# Altium schematic sheet Sheet1.SchDoc
size A4; SheetNumber: 1; SheetTotal: 1
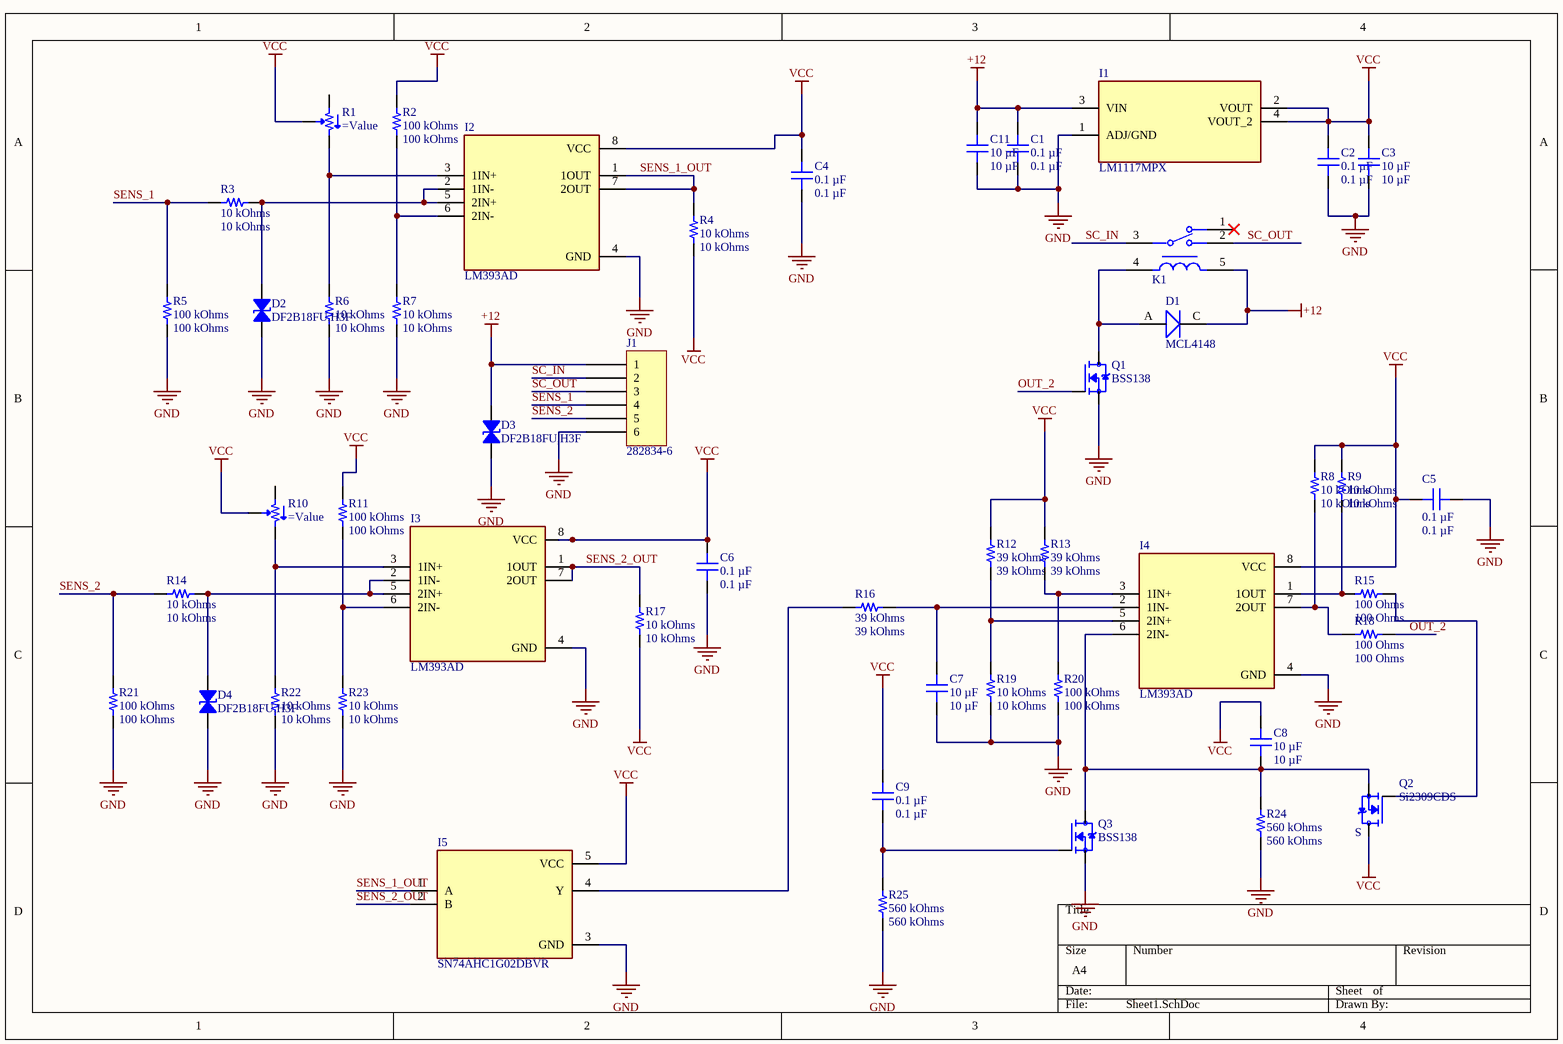
[diagram p0: Sheet1.SchDoc]

## Parts
C1  0.1 µF  [CAP 0603_1608]
C2  0.1 µF  [CAP 0603_1608]
C3  10 µF  [CAP 1206_3216 - 0.8MM]
C4  0.1 µF  [CAP 0603_1608]
C5  0.1 µF  [CAP 0603_1608]
C6  0.1 µF  [CAP 0603_1608]
C7  10 µF  [CAP 1206_3216 - 0.8MM]
C8  10 µF  [CAP 1206_3216 - 0.8MM]
C9  0.1 µF  [CAP 0603_1608]
C11  10 µF  [CAP 1206_3216 - 0.8MM]
D1  MCL4148  [MC4148]
D2  DF2B18FU,H3F  [SOD323]
D3  DF2B18FU,H3F  [SOD323]
D4  DF2B18FU,H3F  [SOD323]
I1  LM1117MPX  [LM1117]
I2  LM393AD  [PCBComponent_1]
I3  LM393AD  [PCBComponent_1]
I4  LM393AD  [PCBComponent_1]
I5  SN74AHC1G02DBVR  [PCBComponent_1 - duplicate]
J1  282834-6  [TE 282834-6]
K1  CP1-12V  [Panasonic_0_MFG]  (value not drawn)
Q1  BSS138  [BSS138]
Q2  Si2309CDS  [BSS138]
Q3  BSS138  [BSS138]
R1  (no value)  [BOURNS TRIMPOT 3296W]
R2  100 kOhms  [RES 0603_1608]
R3  10 kOhms  [RES 0603_1608]
R4  10 kOhms  [RES 0603_1608]
R5  100 kOhms  [RES 0603_1608]
R6  10 kOhms  [RES 0603_1608]
R7  10 kOhms  [RES 0603_1608]
R8  10 kOhms  [RES 0603_1608]
R9  10 kOhms  [RES 0603_1608]
R10  (no value)  [BOURNS TRIMPOT 3296W]
R11  100 kOhms  [RES 0603_1608]
R12  39 kOhms  [RES 0603_1608]
R13  39 kOhms  [RES 0603_1608]
R14  10 kOhms  [RES 0603_1608]
R15  100 Ohms  [RES 0603_1608]
R16  39 kOhms  [RES 0603_1608]
R17  10 kOhms  [RES 0603_1608]
R18  100 Ohms  [RES 0603_1608]
R19  10 kOhms  [RES 0603_1608]
R20  100 kOhms  [RES 0603_1608]
R21  100 kOhms  [RES 0603_1608]
R22  10 kOhms  [RES 0603_1608]
R23  10 kOhms  [RES 0603_1608]
R24  560 kOhms  [RES 0603_1608]
R25  560 kOhms  [RES 0603_1608]

## Nets
+12: C1.2 C11.2 D1.C(K) D3.2 I1.3(VIN) J1.1 K1.5(COIL)
GND: C1.1 C2.1 C3.1 C4.2 C5.2 C6.2 C7.1 C11.1 D2.1 D3.1 D4.1 I1.1(ADJ/GND) I2.4(GND) I3.4(GND) I4.4(GND) I5.3(GND) J1.6 Q1.2(S) Q3.2(S) R5.1 R6.2 R7.2 R19.1 R20.1 R21.1 R22.1 R23.1 R24.1 R25.1
VCC: C2.2 C3.2 C4.1 C5.1 C6.1 C8.2 C9.1 I1.2(VOUT) I1.4(VOUT_2) I2.8(VCC) I3.8(VCC) I4.8(VCC) I5.5(VCC) Q2.3(D) R1.2 R2.2 R4.2 R8.2 R9.2 R10.2 R11.2 R12.2 R13.2 R17.1
OUT_2: Q1.1(G) R18.2
SC_IN: J1.2 K1.3(COM)
SC_OUT: J1.3 K1.2(NO)
SENS_1: J1.4 R3.1 R5.2
SENS_1_OUT: I2.1(1OUT) I2.7(2OUT) I5.1(A) R4.1
SENS_2: J1.5 R14.2 R21.2
SENS_2_OUT: I3.1(1OUT) I3.7(2OUT) I5.2(B) R17.2
NetC7_2: C7.2 I4.2(1IN-) R16.2
NetC8_1: C8.1 I4.6(2IN-) Q2.2(S) Q3.3(D) R24.2
NetC9_2: C9.2 Q3.1(G) R25.2
NetD1_A: D1.A K1.4(COIL) Q1.3(D)
NetD2_2: D2.2 I2.2(1IN-) I2.5(2IN+) R3.2
NetD4_2: D4.2 I3.2(1IN-) I3.5(2IN+) R14.1
NetI2_3: I2.3(1IN+) R1.3 R6.1
NetI2_6: I2.6(2IN-) R2.1 R7.1
NetI3_3: I3.3(1IN+) R10.3 R22.2
NetI3_6: I3.6(2IN-) R11.1 R23.2
NetI4_1: I4.1(1OUT) R9.1 R15.1
NetI4_3: I4.3(1IN+) R13.1 R20.2
NetI4_5: I4.5(2IN+) R12.1 R19.2
NetI4_7: I4.7(2OUT) R8.1 R18.1
NetI5_4: I5.4(Y) R16.1
NetQ2_1: Q2.1(G) R15.2

Not connected (* = marked no-connect by the designer): K1 1(NC)*; R1 1; R10 1

## Library data of the parts
C1 C2 C4-C6 C9 = 0603B104M160CT: CAP CER 0.1UF 16V X7R 0603; Part Number: 0603B104M160CT; Value: 0.1 µF
C3 C7 C8 C11 = C1206C106M4RAC7800: CAP CER 10UF 16V X7R 1206; Part Number: C1206C106M4RAC7800; Value: 10 µF
D2-D4 = DF2B18FU,H3F: TVS DIODE 12VWM 33VC USC; Part Number: DF2B18FU,H3F
J1 = 282834-6: TERM BLK 6P SIDE ENT 2.54MM PCB; Part Number: 282834-6
K1 = CP1-12V: Relays 12VDC 225Ohm 20(NO)/10(NC)A SPDT(14mm 13mm 9.5mm) THT Automotive Relay Automotive; Manufacturer: Panasonic; Coil Current: 53.3mA; Coil Power: 640mW; Coil Resistance: 225Ω; Coil Type: Non-Latching; Coil Voltage: 12V; Number Of Contacts: 1; Standoff Height: 0.3mm; Symbol Hash: fe78fdfa570af3e722bc44d6543b65f3de2fc8a39f1146d236955811f6049f9c; Datasheet Path: datasheets/Relay_Panasonic_CP1-12V_eec.pdf; Ambient Temperature Range High: +85°C; Ambient Temperature Range Low: -40°C; Automotive: No; Category: Relay; ComponentLink1Description: Upverter; ComponentLink1URL: https://upverter.com/part/id/f0cb69e971a210b5/; ComponentLink2Description: Datasheet; ComponentLink2URL: http://datasheet.octopart.com/CP1-12V-Panasonic-datasheet-10206954.pdf; Device Class L1: Electromechanical; Device Class L2: Relays; Device Class L3: Power Relays; Digikey Description: RELAY AUTOMOTIVE SPDT 20A 12V; Digikey Part Number: 255-1939-ND; Height: 9.8mm; Lead Free: Yes; Mouser Description: Relays 12VDC 225Ohm 20(NO)/10(NC)A SPDT(14mm 13mm 9.5mm) THT Automotive Relay Automotive; Mouser Part Number: 769-CP1-12V; Package: 0; Part Number: CP1-12V; RoHS: TRUE; Supplier 1: Digi-Key; Supplier 2: Mouser; Supplier Part Number 1: 255-1939-ND; Supplier Part Number 2: 769-CP1-12V; Temperature: to; Throw Configuration: SPDT; helpURL: https://upverter.com/part/id/f0cb69e971a210b5/
R1 R10 = 3296W-1-203A: TRIMMER 20K OHM 0.5W PC PIN TOP; Part Number: 3296W-1-203A
R2 R5 R11 R20 R21 = AC0603FR-10100KL: RES 100K OHM 1% 1/10W 0603; Part Number: AC0603FR-10100KL; Value: 100 kOhms
R3 R4 R6-R9 R14 R17 R19 R22 R23 = SG73P1JTTD103G: RES 10K OHM 2% 1/3W 0603; Part Number: SG73P1JTTD103G; Value: 10 kOhms
R12 R13 R16 = ERJ-H3EF3902V: RES 39K OHM 1% 1/8W 0603; Part Number: ERJ-H3EF3902V; Value: 39 kOhms
R15 R18 = RK73B1JRTTD101J: RES 100 OHM 5% 1/8W 0603; Part Number: RK73B1JRTTD101J; Value: 100 Ohms
R24 R25 = RCS0603560KFKEA: RES SMD 560K OHM 1% 1/4W 0603; Part Number: RCS0603560KFKEA; Value: 560 kOhms